# EAGLE design Laserschwert (EAGLE 7.3.0)
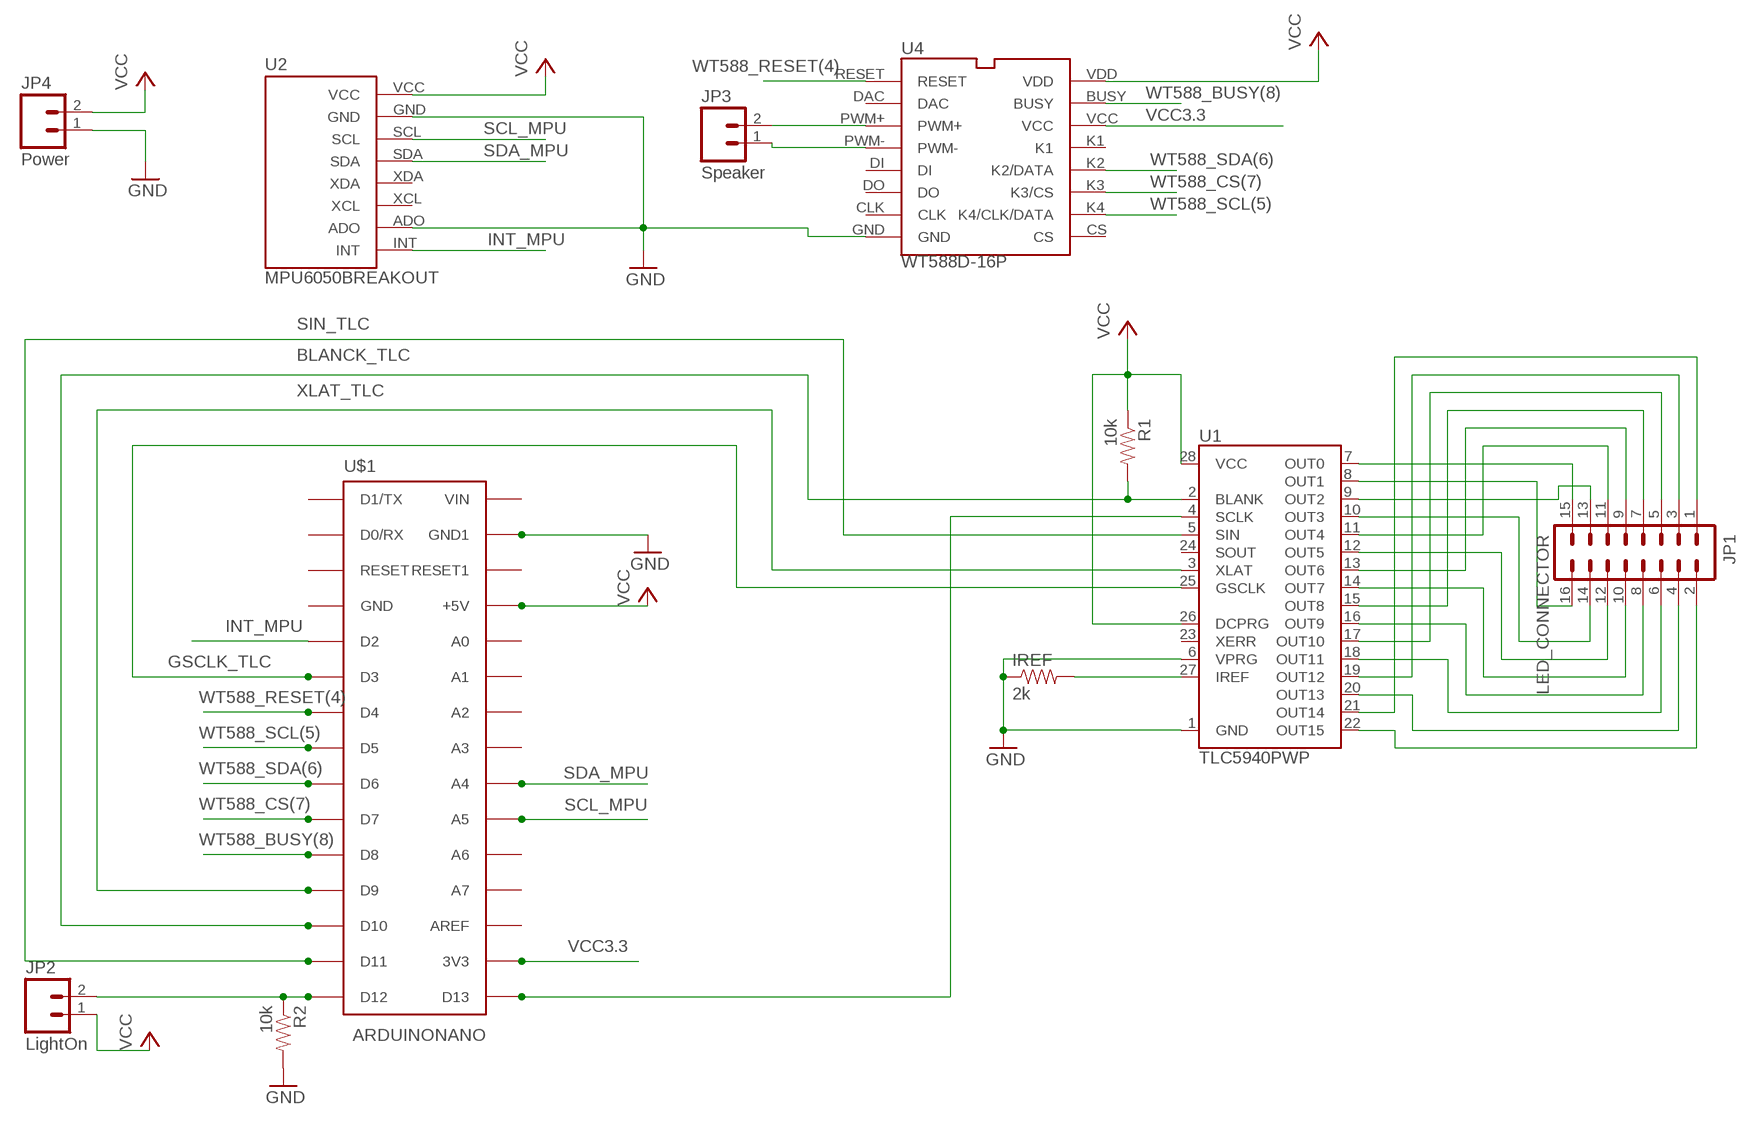
[diagram p0: schematic, sheet 1]

## Parts
IREF  2k  RESISTOR0805-RES  [0805]
JP1  LED_CONNECTOR  M08X2  [2X8]
JP2  LightOn  M02PTH  [1X02]
JP3  Speaker  M02PTH  [1X02]
JP4  Power  M02PTH  [1X02]
R1  10k  RESISTOR0805-RES  [0805]
R2  10k  RESISTOR0805-RES  [0805]
U1  TLC5940PWP  [TSSOP28-GROUNDPAD]
U2  MPU6050BREAKOUT  [PDIP-8]
U4  WT588D-16P  [PDIP-16]
U$1  ARDUINONANO  [PDIP-32]

## Nets
BLANCK_TLC: R1.2 U1.2(BLANK) U$1.D10
GND: IREF.1 JP4.1 R2.2 U1.1(GND) U1.6(VPRG) U2.ADO U2.GND U4.GND U$1.GND1
GSCLK_TLC: U1.25(GSCLK) U$1.D3
INT_MPU: U2.INT U$1.D2
N$1: JP1.15 U1.7(OUT0)
N$2: JP1.16 U1.8(OUT1)
N$3: JP1.13 U1.9(OUT2)
N$4: JP1.14 U1.10(OUT3)
N$5: JP1.11 U1.11(OUT4)
N$6: JP1.12 U1.12(OUT5)
N$7: JP1.9 U1.13(OUT6)
N$8: JP1.10 U1.14(OUT7)
N$9: JP1.7 U1.15(OUT8)
N$10: JP1.8 U1.16(OUT9)
N$11: JP1.5 U1.17(OUT10)
N$12: JP1.6 U1.18(OUT11)
N$13: JP1.3 U1.19(OUT12)
N$14: JP1.4 U1.20(OUT13)
N$15: JP1.1 U1.21(OUT14)
N$16: JP1.2 U1.22(OUT15)
N$17: JP2.2 R2.1 U$1.D12
N$18: IREF.2 U1.27(IREF)
N$24: U1.4(SCLK) U$1.D13
N$25: JP3.2 U4.PWM+
N$26: JP3.1 U4.PWM-
SCL_MPU: U2.SCL U$1.A5
SDA_MPU: U2.SDA U$1.A4
SIN_TLC: U1.5(SIN) U$1.D11
VCC: JP2.1 JP4.2 R1.1 U1.26(DCPRG) U1.28(VCC) U2.VCC U4.VDD U$1.+5V
VCC3.3: U4.VCC U$1.3V3
WT588_BUSY(8): U4.BUSY U$1.D8
WT588_CS(7): U4.K3(K3/CS) U$1.D7
WT588_RESET(4): U4.RESET U$1.D4
WT588_SCL(5): U4.K4(K4/CLK/DATA) U$1.D5
WT588_SDA(6): U4.K2(K2/DATA) U$1.D6
XLAT_TLC: U1.3(XLAT) U$1.D9
Unconnected: U1.23(XERR) U1.24(SOUT) U2.XCL U2.XDA U4.CLK U4.CS U4.DAC U4.DI U4.DO U4.K1 U$1.A0 U$1.A1 U$1.A2 U$1.A3 U$1.A6 U$1.A7 U$1.AREF U$1.D0/RX U$1.D1/TX U$1.GND U$1.RESET U$1.RESET1 U$1.VIN

## Library data of the parts
IREF R1 R2 = SparkFun-Resistors:RESISTOR: Resistor Basic schematic elements and footprints for 0603, 1206, and PTH resistors.
JP1 = SparkFun-Connectors:M08X2: .1" headers, two rows of 8 each
JP2-JP4 = SparkFun-Connectors:M02: Standard 2-pin 0.1" header. Use with - straight break away headers ( PRT-00116) - right angle break away headers (PRT-00553) - swiss pins (PRT-00743) - machine pins (PRT-00117) - female headers (PRT-00115) Molex polarized connector foot print use with: PRT-08233 with associated crimp pins and housings. 2.54_SCREWTERM for use with PRT-10571. 3.5mm Screw Terminal footprints for PRT-08084 5mm Screw Terminal footprints for use with PRT-08432
U1 = SparkFun-DigitalIC:TLC5940: 16-channel LED Driver with Dot Correction and Grayscale PWM Control The TLC5940 is a 16-channel, constant-current sink LED driver. Each channel has an individually adjustable 4096-step grayscale PWM brightness control and a 64-step, constant-current sink (dot correction). The dot correction adjusts the brightness variations between LED channels and other LED drivers. The dot correction data is stored in an integrated EEPROM. Both grayscale control and dot correction are accessible via a serial interface. A single external resistor sets the maximum current value of all 16 channels. Packages: 28-pin HTSSOP 32-pin 5x5mm QFN 28-pin DIP
U2 = MPU6050_Breakout:MPU6050BREAKOUT: Breakout board for mPU 6050 Gyro and Acceleration Sensor
U4 = WT588D-Soundmodule:WT588D-16P: Breakout board WT588D-16P V1.1 Sound Module
U$1 = jet-lib:ARDUINONANO

## Board
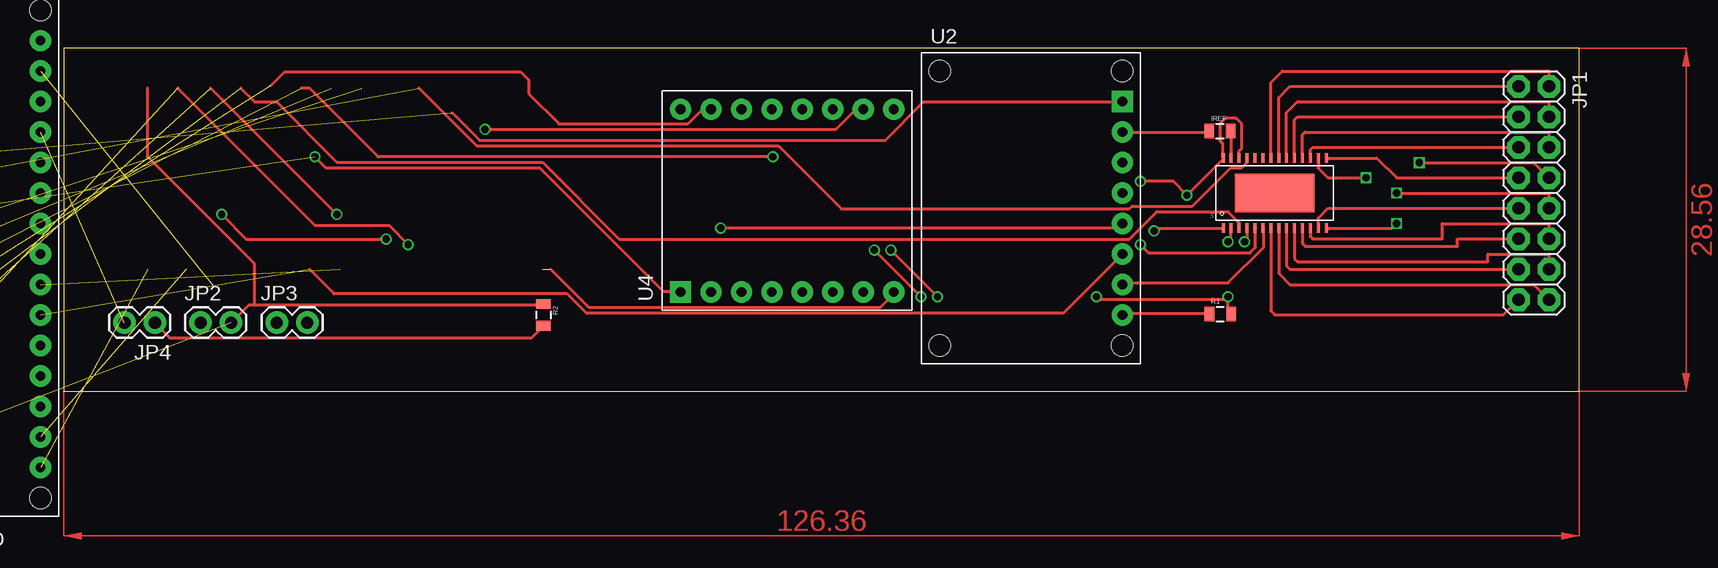
[diagram p1: board, top side]
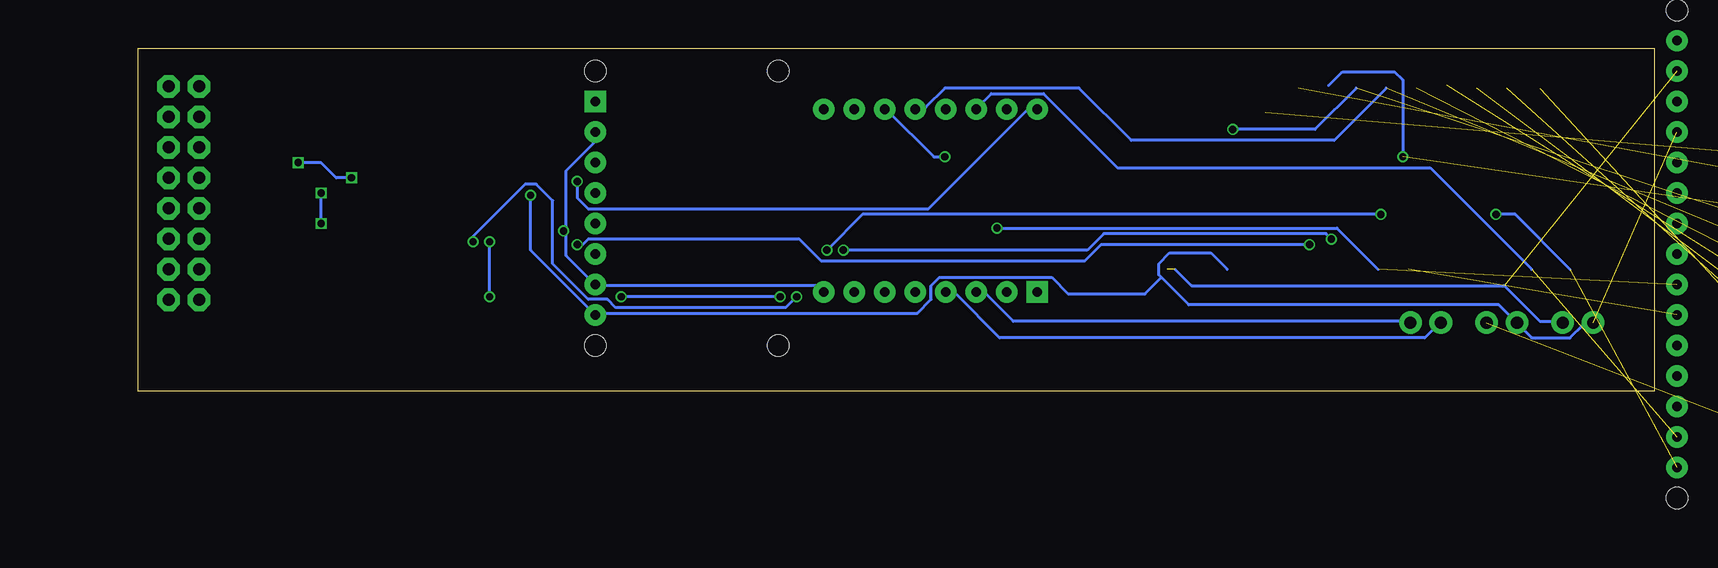
[diagram p2: board, bottom side, seen from below]

Size 126.37 x 28.59 mm. Coordinates in mm from the lower left corner, seen from the top.
Outline: 0,0 126.36,0 126.36,28.56 0,28.59 0,0
Copper layers (1*16): Top 0.035mm / dielectric 1.5mm / Bottom 0.035mm
Design rules "multi-cb_035um-cu": minimum track width 6mil, minimum drill 12mil, track to track 6mil, track to pad 6mil, pad to pad 6mil, via to via 6mil, smd to smd 6mil, copper to edge 20mil, drill to drill 8mil, minimum pad ring 8mil, minimum via ring 6mil, stop-mask expansion 3mil, vias tented up to drill 0mil, thermal gap 8mil

### Footprints (pad centres in the part's own frame; a part is rotated, then mirrored left to right if it is on the bottom)
0805 = smd 0.8 x 1.2: 1 -0.9,0; 2 0.9,0
2X8 = drill 1.016 pad 1.88 octagon: 1 0,0; 2 0,2.54; 3 2.54,0; 4 2.54,2.54; 5 5.08,0; 6 5.08,2.54; 7 7.62,0; 8 7.62,2.54; 9 10.16,0; 10 10.16,2.54; 11 12.7,0; 12 12.7,2.54; 13 15.24,0; 14 15.24,2.54; 15 17.78,0; 16 17.78,2.54
1X02 = drill 1.016 pad 1.88: 1 0,0; 2 2.54,0
TSSOP28-GROUNDPAD = smd 0.8 x 0.25: 1 -2.921,4.298; 2 -2.921,3.637; 3 -2.921,2.977; 4 -2.921,2.317; 5 -2.921,1.656; 6 -2.921,0.996; 7 -2.921,0.335; 8 -2.927,-0.325; 9 -2.921,-0.985; 10 -2.921,-1.646; 11 -2.921,-2.306; 12 -2.921,-2.967; 13 -2.921,-3.627; 14 -2.921,-4.287; 15 2.921,-4.287; 16 2.921,-3.627; 17 2.921,-2.967; 18 2.921,-2.306; 19 2.921,-1.646; 20 2.921,-0.985; 21 2.927,-0.325; 22 2.921,0.335; 23 2.921,0.996; 24 2.921,1.656; 25 2.921,2.317; 26 2.921,2.977; 27 2.921,3.637; 28 2.921,4.298 | smd 3.2 x 6.6: 29 0,0.005
PDIP-8 = drill 0.8 pad 1.778: ADO 15.24,-5.08; GND 15.24,-17.78; SCL 15.24,-15.24; SDA 15.24,-12.7; VCC 15.24,-20.32; XCL 15.24,-7.62; XDA 15.24,-10.16 | drill 0.8 pad 1.778 square: INT 15.24,-2.54 | hole 1.778: 0,0; 15.24,0; 0,-22.86; 15.24,-22.86
PDIP-16 = drill 0.8 pad 1.778: BUSY 15.24,-5.08; CLK 0,-17.78; CS 15.24,-20.32; DAC 0,-5.08; DI 0,-12.7; DO 0,-15.24; GND 0,-20.32; K1 15.24,-10.16; K2 15.24,-12.7; K3 15.24,-15.24; K4 15.24,-17.78; PWM+ 0,-7.62; PWM- 0,-10.16; VCC 15.24,-7.62; VDD 15.24,-2.54 | drill 0.8 pad 1.778 square: RESET 0,-2.54
PDIP-32 = drill 0.8 pad 1.778: 3V3 15.24,-35.56; +5V 15.24,-10.16; A0 15.24,-12.7; A1 15.24,-15.24; A2 15.24,-17.78; A3 15.24,-20.32; A4 15.24,-22.86; A5 15.24,-25.4; A6 15.24,-27.94; A7 15.24,-30.48; AREF 15.24,-33.02; D0/RX 0,-5.08; D2 0,-12.7; D3 0,-15.24; D4 0,-17.78; D5 0,-20.32; D6 0,-22.86; D7 0,-25.4; D8 0,-27.94; D9 0,-30.48; D10 0,-33.02; D11 0,-35.56; D12 0,-38.1; D13 15.24,-38.1; GND 0,-10.16; GND1 15.24,-5.08; RESET 0,-7.62; RESET1 15.24,-7.62; VIN 15.24,-2.54 | drill 0.8 pad 1.778 square: D1/TX 0,-2.54 | hole 1.778: 0,0; 0,-40.64; 15.24,-40.64; 15.24,0

### Placement (x,y rotation side)
IREF  96.39,21.67 0 top
JP1  121.28,25.4 270 top
JP2  11.43,5.71 0 top
JP3  17.78,5.71 0 top
JP4  7.62,5.71 180 top
R1  96.42,6.43 0 top
R2  40.01,6.35 270 top
U1  100.97,16.51 90 top
U2  73.03,26.67 0 top
U4  48.9,8.26 90 top
U$1  -17.14,31.75 0 top

### Tracks (layer width: path | path; a pad name or v marks a point on that pad's centre or on a via)
BLANCK_TLC  (via drill 0.61)  (1 unrouted)
  Top 0.254: v97.08,12.45 97.31,12.68 97.31,13.59 U1.2 | 97.08,7.64 97.08,6.73 97.31,6.5 R1.2 | 97.08,7.64 86.34,7.64 v86.11,7.87 | v68.96,11.76 v72.85,7.87 | 12.27,25.25 v22.78,14.73 | 97.08,7.64 v97.08,7.87
  Bottom 0.254: v97.08,7.87 v97.08,12.45 | v72.85,7.87 v86.11,7.87 | v68.96,11.76 65.99,14.73 v22.78,14.73
GND  (via drill 0.61)  (2 unrouted)
  Top 0.254: R2.2 39.93,5.36 39.01,4.45 8.84,4.45 7.7,5.59 JP4.1 | U2.ADO 95.48,21.59 IREF.1 | 40.62,10.16 43.81,6.96 68.05,6.96 69.19,8.1 U4.GND | U1.1 91.14,13.59 v90.91,13.36 | U1.6 100.05,13.59 100.05,11.99 97.08,9.02 88.39,9.02 U2.GND
  Bottom 0.254: 90.68,13.36 90.68,11.3 U2.GND 88.16,8.79 69.88,8.79 69.42,8.33 U4.GND | 90.68,13.36 90.68,18.39 88.39,20.68 88.39,21.59 U2.ADO | 39.93,10.16 38.56,8.79 12.5,8.79 9.53,5.82 7.7,5.82 JP4.1 | 90.68,13.36 v90.91,13.36
GSCLK_TLC  (1 unrouted)
  Top 0.254: 29.64,25.25 34.44,20.45 59.59,20.45 64.85,15.19 88.85,15.19 89.08,15.42 94.11,15.42 97.31,18.62 98.22,18.62 98.68,19.08 98.68,19.3 U1.25
INT_MPU  (1 unrouted)
  Top 0.254: 32.39,23.19 34.67,20.9 68.5,20.9 71.7,24.11 88.16,24.11 U2.INT
N$1
  Top 0.254: U1.7 100.63,6.69 100.97,6.35 120.02,6.35 JP1.15
N$2
  Top 0.254: U1.8 101.29,9.84 102.23,8.89 122.56,8.89 JP1.16
N$3
  Top 0.254: U1.9 101.95,10.45 102.23,10.16 JP1.13
N$4
  Top 0.254: JP1.14 123.83,11.43 118.75,11.43 118.75,10.8 102.87,10.8 102.61,11.05 U1.10
N$5
  Top 0.254: U1.11 103.27,12.3 103.5,12.07 116.2,12.07 116.2,12.7 JP1.11
N$6
  Top 0.254: U1.12 103.93,12.91 104.14,12.7 114.94,12.7 114.94,13.97 123.83,13.97 JP1.12
N$7
  Top 0.254: U1.13 104.59,14.42 105.41,15.24 JP1.9
N$8  (via drill 0.6)
  Top 0.254: U1.14 110.74,13.59 v111.12,13.97 | v111.12,16.51 123.83,16.51 JP1.10
  Bottom 0.254: v111.12,13.97 v111.12,16.51
N$9
  Top 0.254: U1.15 109.47,19.43 111.12,17.78 JP1.7
N$10  (via drill 0.6)
  Top 0.254: U1.16 104.59,18.6 105.41,17.78 v108.59,17.78 | v113.03,19.05 122.56,19.05 JP1.8
  Bottom 0.254: v108.59,17.78 109.86,17.78 111.12,19.05 v113.03,19.05
N$11
  Top 0.254: U1.17 103.93,20.11 104.14,20.32 JP1.5
N$12
  Top 0.254: U1.18 103.27,21.36 103.5,21.59 123.83,21.59 JP1.6
N$13
  Top 0.254: U1.19 102.61,22.6 102.87,22.86 JP1.3
N$14
  Top 0.254: U1.20 101.95,23.21 102.87,24.13 123.83,24.13 JP1.4
N$15
  Top 0.254: U1.21 101.29,24.45 102.23,25.4 JP1.1
N$16
  Top 0.254: U1.22 100.63,25.7 101.6,26.67 123.83,26.67 JP1.2
N$17  (1 unrouted)
  Top 0.254: 15.93,7.19 15.47,7.19 14.1,5.82 JP2.2 | 15.93,7.19 39.93,7.19 R2.1 | 7.01,25.25 7.01,19.53 15.93,10.62 15.93,7.19
N$18
  Top 0.254: U1.27 97.31,19.53 97.31,21.59 IREF.2
N$24  (via drill 0.61)  (1 unrouted)
  Top 0.254: v98.45,12.45 98.68,12.68 98.68,13.59 U1.4 | v67.59,11.76 v71.48,7.87 | v26.9,12.68 15.24,12.68 v13.18,14.73
  Bottom 0.254: v98.45,12.45 98.45,12.9 94.11,17.25 93.19,17.25 91.82,15.88 91.82,10.62 88.85,7.64 87.25,7.64 86.56,6.96 72.39,6.96 v71.48,7.87 | v67.59,11.76 47.24,11.76 45.87,13.13 27.36,13.13 v26.9,12.68 | v13.18,14.73 11.58,14.73 7.01,10.16
N$25
  Bottom 0.254: U4.PWM+ 56.39,8.1 55.7,8.1 53.42,5.82 20.5,5.82 JP3.2
N$26
  Bottom 0.254: U4.PWM- 58.9,8.1 58.22,8.1 54.56,4.45 19.13,4.45 17.98,5.59 JP3.1
SCL_MPU  (1 unrouted)
  Top 0.254: 20.5,10.16 22.55,8.1 41.99,8.1 43.59,6.5 83.36,6.5 88.16,11.3 U2.SCL
SDA_MPU  (via drill 0.61)  (1 unrouted)
  Top 0.254: v54.79,13.59 87.94,13.59 88.16,13.82 U2.SDA
  Bottom 0.254: 23.01,10.16 26.44,13.59 v54.79,13.59
SIN_TLC  (via drill 0.61)  (1 unrouted)
  Top 0.254: v89.76,12.22 90.45,11.53 98.91,11.53 99.36,11.99 99.36,13.59 U1.5 | v28.73,12.22 27.13,13.82 20.96,13.82 9.53,25.25
  Bottom 0.254: v89.76,12.22 89.31,12.22 88.85,12.68 71.25,12.68 69.42,10.85 47.47,10.85 46.1,12.22 v28.73,12.22
VCC  (via drill 0.61)  (1 unrouted)
  Top 0.254: U1.26 97.99,19.53 97.99,19.99 98.22,20.22 98.22,22.28 97.77,22.73 96.85,22.73 96.39,22.28 96.39,20.9 96.62,20.68 96.62,19.53 U1.28 96.62,19.3 v93.65,16.33 92.51,17.48 v89.76,17.48 | R1.1 95.48,6.5 88.39,6.5 U2.VCC
  Bottom 0.254: JP4.2 5.18,5.59 5.87,5.59 7.01,4.45 10.21,4.45 11.35,5.59 JP2.1 11.58,5.82 12.95,7.19 38.79,7.19 41.07,9.47 | 35.59,10.16 36.96,11.53 40.39,11.53 41.3,10.62 41.3,9.7 41.07,9.47 | v93.65,16.33 93.65,11.76 88.39,6.5 U2.VCC 88.16,6.5 61.42,6.5 60.27,7.64 60.27,8.79 59.59,9.47 50.22,9.47 48.84,8.1 42.44,8.1 41.07,9.47 | v89.76,17.48 89.76,16.1 88.85,15.19 60.5,15.19 52.27,23.42 51.59,23.42 U4.VDD
VCC3.3  (1 unrouted)
  Bottom 0.254: 10.21,10.16 18.67,18.62 44.73,18.62 50.9,24.79 55.25,24.79 56.39,23.65 U4.VCC
WT588_BUSY(8)  (1 unrouted)
  Top 0.254: 17.3,25.48 18.44,26.62 38.1,26.62 38.79,25.93 38.79,24.79 41.3,22.28 52.05,22.28 53.19,23.42 53.87,23.42 U4.BUSY
WT588_CS(7)  (via drill 0.61)  (1 unrouted)
  Top 0.254: 19.81,25.25 20.5,25.25 26.21,19.53 v59.13,19.53
  Bottom 0.254: v59.13,19.53 60.05,19.53 63.93,23.42 U4.K3
WT588_RESET(4)  (via drill 0.61)  (1 unrouted)
  Top 0.254: v20.96,19.53 21.87,18.62 39.7,18.62 49.99,8.33 51.36,8.33 U4.RESET
  Bottom 0.254: v20.96,19.53 20.96,25.93 21.64,26.62 25.98,26.62 27.13,25.48
WT588_SCL(5)  (via drill 0.61)  (1 unrouted)
  Top 0.254: v35.13,21.82 64.39,21.82 65.99,23.42 66.68,23.42 U4.K4
  Bottom 0.254: v35.13,21.82 28.27,21.82 24.84,25.25
WT588_SDA(6)  (1 unrouted)
  Bottom 0.254: 22.33,25.25 26.67,20.9 43.59,20.9 47.93,25.25 59.13,25.25 60.73,23.65 61.42,23.65 U4.K2
XLAT_TLC  (1 unrouted)
  Top 0.254: 14.78,25.25 15.93,24.11 17.76,24.11 22.78,19.08 39.93,19.08 46.33,12.68 88.85,12.68 91.14,14.96 97.08,14.96 97.99,14.05 U1.3
(copper drawn outside any net)
  shapes: Top area x2